# Altium schematic sheet LOGIC_CONNECTOR.SchDoc
size Letter; SheetNumber: 4; SheetTotal: 5
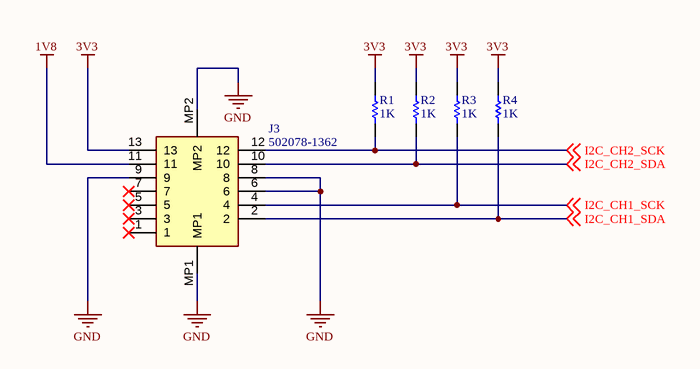
[diagram p0: LOGIC_CONNECTOR.SchDoc]

## Parts
J3  502078-1362  [5020781362]
R1  1K  [RESC1005X40X25LL05T10]
R2  1K  [RESC1005X40X25LL05T10]
R3  1K  [RESC1005X40X25LL05T10]
R4  1K  [RESC1005X40X25LL05T10]

## Nets
1V8: J3.11
3V3: J3.13 R1.2 R2.2 R3.2 R4.2
GND: J3.6 J3.8 J3.9 J3.MP1 J3.MP2
I2C_CH1_SCK: J3.4 R3.1 ; off-sheet I2C_CH1_SCK
I2C_CH1_SDA: J3.2 R4.1 ; off-sheet I2C_CH1_SDA
I2C_CH2_SCK: J3.12 R1.1 ; off-sheet I2C_CH2_SCK
I2C_CH2_SDA: J3.10 R2.1 ; off-sheet I2C_CH2_SDA

Not connected (* = marked no-connect by the designer): J3 1* 3* 5* 7*

## Notes on the sheet
- Title
- Copyright (c) Meta Platforms, Inc. and affiliates.
  All rights reserved.
  This source code is licensed under the license found in the
  LICENSE file in the root directory of this source tree.
- Sheet
- of

## Library data of the parts
J3 = 502078-1362: Connector; Manufacturer_Name: Molex; Datasheet Link: https://www.molex.com/pdm_docs/sd/5020781362_sd.pdf; Height: 1.7mm; Manufacturer_Part_Number: 502078-1362; Mouser Part Number: 538-502078-1362; Mouser Price/Stock: https://www.mouser.co.uk/ProductDetail/Molex/502078-1362?qs=GBLSl2Akirt8csfPYHMErA%3D%3D
R1-R4 = CMP-2002-07941-1: Part Number: RC0402JR-071KL; Manufacturer: Yageo / Phycomp